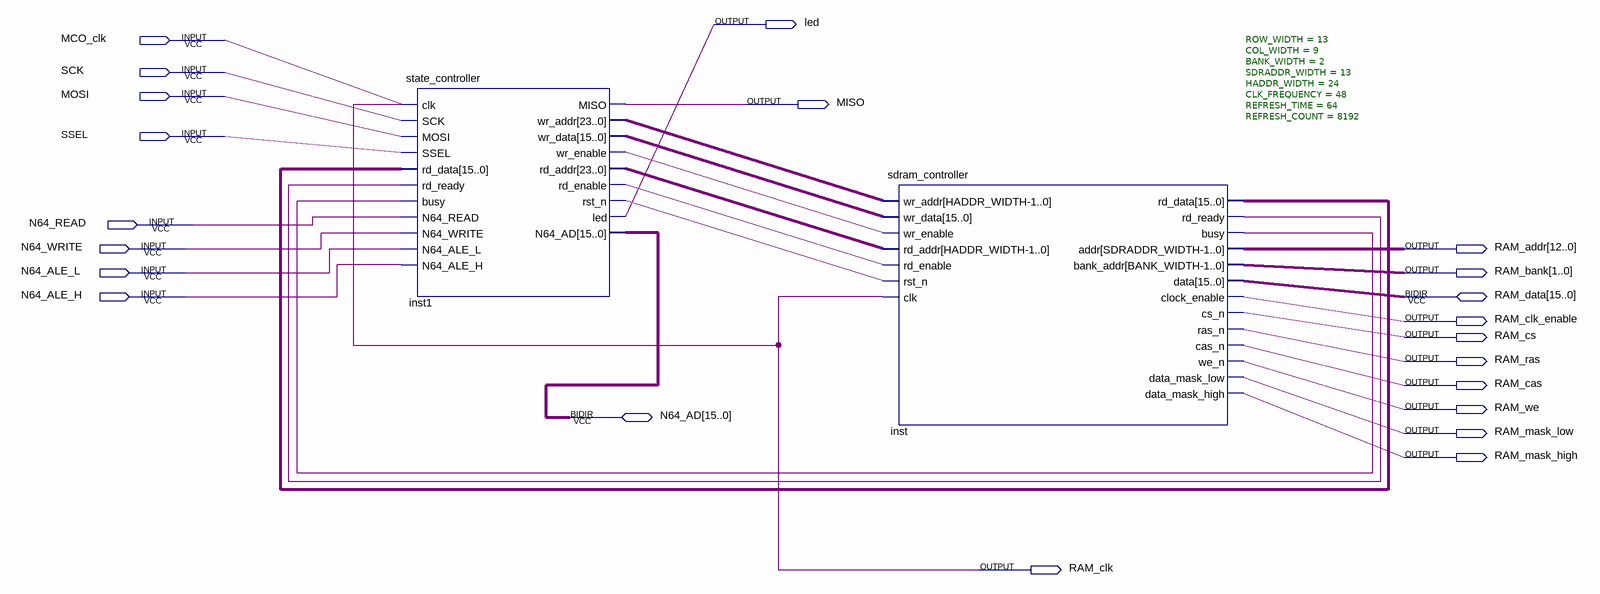
[diagram p0: schematic sheet]
// Quartus schematic elbarato64.bdf as structural Verilog: 2 symbols, 22 pins
module elbarato64 (
  input  MCO_clk,
  input  SCK,
  input  MOSI,
  input  SSEL,
  input  N64_READ,
  input  N64_WRITE,
  input  N64_ALE_L,
  input  N64_ALE_H,
  inout  [15:0] RAM_data,
  inout  [15:0] N64_AD,
  output led,
  output MISO,
  output [12:0] RAM_addr,
  output [1:0] RAM_bank,
  output RAM_clk_enable,
  output RAM_cs,
  output RAM_ras,
  output RAM_cas,
  output RAM_we,
  output RAM_mask_low,
  output RAM_mask_high,
  output RAM_clk
);

  wire inst1_rd_enable, inst1_rst_n, inst1_wr_enable, inst_busy, inst_rd_ready;
  wire [15:0] inst1_wr_data, inst_rd_data;
  wire [23:0] inst1_rd_addr, inst1_wr_addr;

  state_controller inst1 (
    .clk(MCO_clk), .SCK(SCK), .MOSI(MOSI), .SSEL(SSEL), .rd_data(inst_rd_data), .rd_ready(inst_rd_ready),
    .busy(inst_busy), .N64_READ(N64_READ), .N64_WRITE(N64_WRITE), .N64_ALE_L(N64_ALE_L),
    .N64_ALE_H(N64_ALE_H), .MISO(MISO), .wr_addr(inst1_wr_addr), .wr_data(inst1_wr_data),
    .wr_enable(inst1_wr_enable), .rd_addr(inst1_rd_addr), .rd_enable(inst1_rd_enable), .rst_n(inst1_rst_n),
    .led(led), .N64_AD(N64_AD));
  sdram_controller #(.ROW_WIDTH(13), .COL_WIDTH(9), .BANK_WIDTH(2), .SDRADDR_WIDTH(13), .HADDR_WIDTH(24), .CLK_FREQUENCY(48), .REFRESH_TIME(64), .REFRESH_COUNT(8192)) inst (
    .wr_addr(inst1_wr_addr), .wr_data(inst1_wr_data), .wr_enable(inst1_wr_enable), .rd_addr(inst1_rd_addr),
    .rd_enable(inst1_rd_enable), .rst_n(inst1_rst_n), .clk(MCO_clk), .rd_data(inst_rd_data),
    .rd_ready(inst_rd_ready), .busy(inst_busy), .addr(RAM_addr), .bank_addr(RAM_bank),
    .clock_enable(RAM_clk_enable), .cs_n(RAM_cs), .ras_n(RAM_ras), .cas_n(RAM_cas), .we_n(RAM_we),
    .data_mask_low(RAM_mask_low), .data_mask_high(RAM_mask_high), .data(RAM_data));

  assign RAM_clk = MCO_clk;
endmodule
